# Altium schematic sheet Sheet1.SchDoc
size A4; SheetNumber: 1; SheetTotal: 1
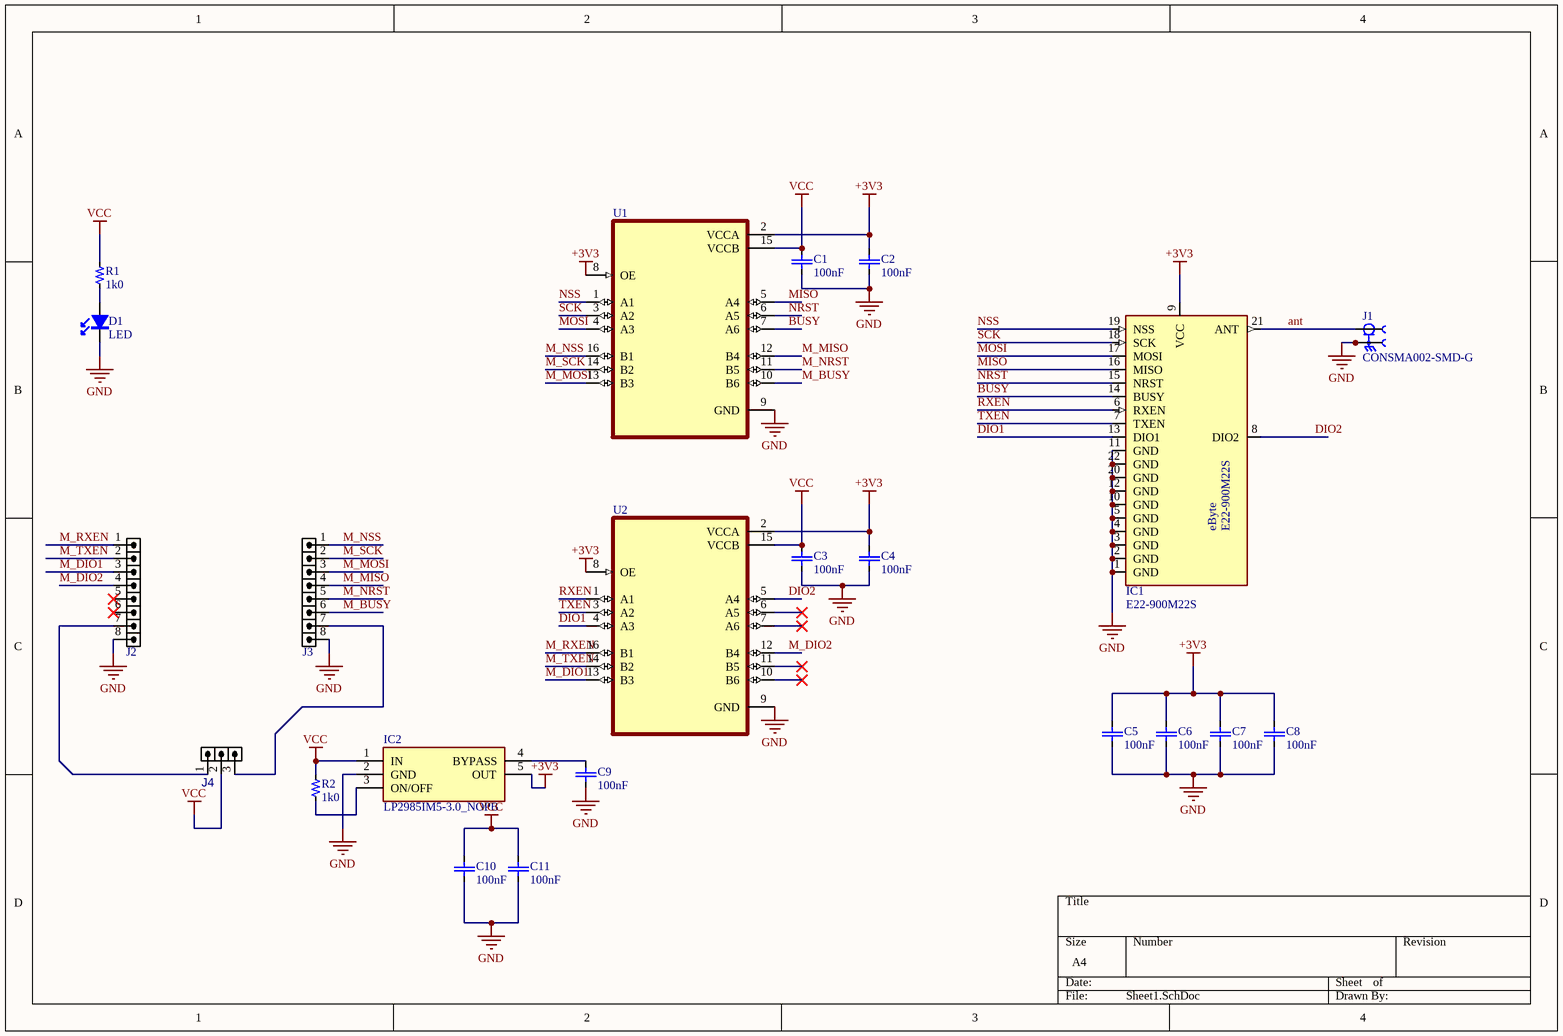
[diagram p0: Sheet1.SchDoc]

## Parts
C1  100nF  [C0805]
C2  100nF  [C0805]
C3  100nF  [C0805]
C4  100nF  [C0805]
C5  100nF  [C0805]
C6  100nF  [C0805]
C7  100nF  [C0805]
C8  100nF  [C0805]
C9  100nF  [C0805]
C10  100nF  [C0805]
C11  100nF  [C0805]
D1  LED  [LED-0805]
IC1  E22-900M22S  [E22-900M22S]
IC2  LP2985IM5-3.0_NOPB  [SOT95P280X145-5N]
J1  CONSMA002-SMD-G  [LINX_CONSMA002-SMD-G]
J2  HDR1X8  [HDR_M_1X8]  (value not drawn)
J3  HDR1X8  [HDR_M_1X8]  (value not drawn)
J4  HDRM3  [HDRS_M_1X3]  (value not drawn)
R1  1k0  [R0805]
R2  1k0  [R0805]
U1  TXB0106PWR  [SOP65P640X120-16N]  (value not drawn)
U2  TXB0106PWR  [SOP65P640X120-16N]  (value not drawn)

## Nets
+3V3: C2.2 C4.2 C5.2 C6.2 C7.2 C8.2 IC1.9(VCC) IC2.5(OUT) U1.2(VCCA) U1.8(OE) U2.2(VCCA) U2.8(OE)
GND: C1.1 C2.1 C3.1 C4.1 C5.1 C6.1 C7.1 C8.1 C9.1 C10.1 C11.1 D1.1 IC1.1(GND) IC1.2(GND) IC1.3(GND) IC1.4(GND) IC1.5(GND) IC1.10(GND) IC1.11(GND) IC1.12(GND) IC1.20(GND) IC1.22(GND) IC2.2(GND) J1.S1 J1.S2 J2.8 J3.8 U1.9(GND) U2.9(GND)
VCC: C1.2 C3.2 C10.2 C11.2 IC2.1(IN) J4.2(P2) R1.2 R2.2 U1.15(VCCB) U2.15(VCCB)
ant: IC1.21(ANT) J1.1
BUSY: IC1.14(BUSY) U1.7(A6)
DIO1: IC1.13(DIO1) U2.4(A3)
DIO2: IC1.8(DIO2) U2.5(A4)
M_BUSY: J3.6 U1.10(B6)
M_DIO1: J2.3 U2.13(B3)
M_DIO2: J2.4 U2.12(B4)
M_MISO: J3.4 U1.12(B4)
M_MOSI: J3.3 U1.13(B3)
M_NRST: J3.5 U1.11(B5)
M_NSS: J3.1 U1.16(B1)
M_RXEN: J2.1 U2.16(B1)
M_SCK: J3.2 U1.14(B2)
M_TXEN: J2.2 U2.14(B2)
MISO: IC1.16(MISO) U1.5(A4)
MOSI: IC1.17(MOSI) U1.4(A3)
NRST: IC1.15(NRST) U1.6(A5)
NSS: IC1.19(NSS) U1.1(A1)
RXEN: IC1.6(RXEN) U2.1(A1)
SCK: IC1.18(SCK) U1.3(A2)
TXEN: IC1.7(TXEN) U2.3(A2)
NetC9_2: C9.2 IC2.4(BYPASS)
NetD1_2: D1.2 R1.1
NetIC2_3: IC2.3(ON/OFF) R2.1
NetJ2_7: J2.7 J4.1(P1)
NetJ3_7: J3.7 J4.3

Not connected (* = marked no-connect by the designer): J2 5* 6*; U2 6(A5)* 7(A6)* 10(B6)* 11(B5)*

## Notes on the sheet
- (in symbol E22-900M22S) eByte

## Library data of the parts
C1-C11 = Capacitor: Capacitor without polarity; Voltage: 25V; Part number: *; Manufacturer: *; Unit price: *; Value: 100nF
D1 = LED: LED - Light-Emitting Diode; Manufacturer: *; Part number: *; Unit price: *; Value: LED
IC1 = E22-900M22S: SX1262 868/915MHz SPI SMD LoRa Module; MF: EBYTE; Package: Package; MP: E22-900M22S; Check_prices: https://www.snapeda.com/parts/E22-900M22S/EBYTE/view-part/5137737/?ref=eda; Value: *; Availability: Unavailable; Price: None; SnapEDA_Link: https://www.snapeda.com/parts/E22-900M22S/EBYTE/view-part/5137737/?ref=snap
IC2 = LP2985IM5-3.0_NOPB: Integrated Circuit; Manufacturer_Name: Texas Instruments; Manufacturer_Part_Number: LP2985IM5-3.0/NOPB; Datasheet Link: http://www.ti.com/lit/ds/symlink/lp2985-n.pdf; Height: 1.45mm; Mouser Part Number: 926-LP2985IM53.0NOPB; Mouser Price/Stock: https://www.mouser.co.uk/ProductDetail/Texas-Instruments/LP2985IM5-3.0-NOPB?qs=7lkVKPoqpbYZPGAMtqQXkQ%3D%3D; Arrow Part Number: LP2985IM5-3.0/NOPB; Arrow Price/Stock: https://www.arrow.com/en/products/lp2985im5-3.0nopb/texas-instruments
J1 = CONSMA002-SMD-G: SMA Female Right-Angle Surface-Mount Connector, Gold; MF: Linx Technologies; SnapEDA_Link: https://www.snapeda.com/parts/CONSMA002-SMD-G/Linx+Technologies+Inc./view-part/?ref=snap; Package: None; Value: *; MP: CONSMA002-SMD-G; Check_prices: https://www.snapeda.com/parts/CONSMA002-SMD-G/Linx+Technologies+Inc./view-part/?ref=eda
J2 J3 = Header Male THT 1x8: CONN, HEADER, Male, pitch: 2.54mm, 8POS; VALUE: HDRM8
J4 = Header Male 1x3 smd: CONN, HEADER, Male, pitch: 2.54mm, 3POS, SMD; MANF_P#: 87898-0304; MANF: MOLEX; DESC: DESCRIPTION; ASSEMBLY: ASSEMBLY; PARAM: PARAM; PRICE: 0.5$; VALUE: HDRM3
R1 R2 = Resistor: Single resistor; Power: 0.125W; Manufacturer: *; Part number: *; Value: 1k0; Unit price: 0.1
U1 U2 = TXB0106PWR: 6-Bit Bidirectional Voltage-Level Translator with Auto Direction Sensing and +/-15-kV ESD Protect 16-TSSOP -40 to 85; MF: Texas Instruments; Texas_Instruments-Purchase-URL: https://snapeda.com/shop?store=Texas+Instruments&id=134340; SnapEDA_Link: https://www.snapeda.com/parts/TXB0106PWR/Texas%20Instruments/view-part/134340/?ref=snap; Value: *; MP: TXB0106PWR; Package: TSSOP-16 Texas Instruments; DigiKey-Purchase-URL: https://snapeda.com/shop?store=DigiKey&id=134340; Availability: Warning; Price: None; Mouser-Purchase-URL: https://snapeda.com/shop?store=Mouser&id=134340; BuyPart: https://www.snapeda.com/parts/TXB0106PWR/Texas%20Instruments/view-part/134340/?ref=eda